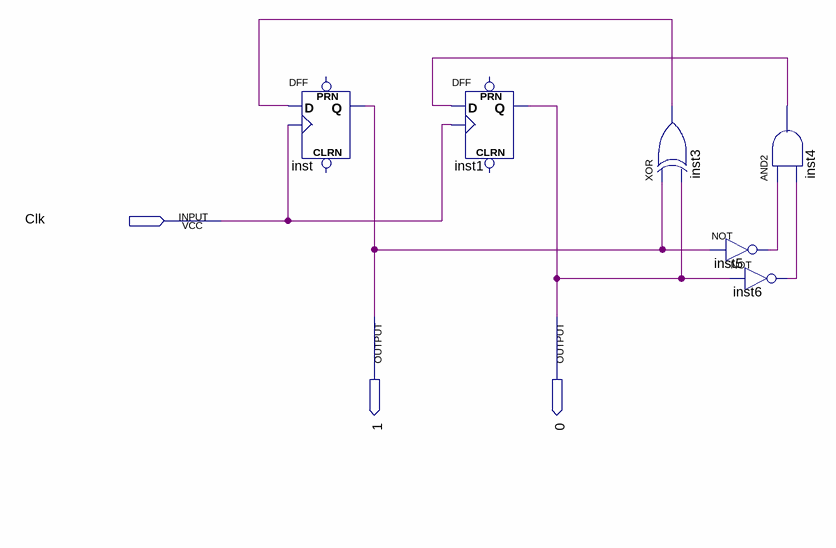
[diagram p0: schematic sheet]
// Quartus schematic Contador2.bdf as structural Verilog: 6 symbols, 3 pins
module Contador2 (
  input  Clk,
  output \1 ,
  output \0 
);

  wire inst3_out, inst4_out, inst5_out, inst6_out;

  DFF inst (.CLK(Clk), .D(inst3_out), .Q(\1 ));  // open: CLRN, PRN
  DFF inst1 (.CLK(Clk), .D(inst4_out), .Q(\0 ));  // open: CLRN, PRN
  xor inst3 (inst3_out, \1 , \0 );
  and inst4 (inst4_out, inst5_out, inst6_out);
  not inst5 (inst5_out, \1 );
  not inst6 (inst6_out, \0 );
endmodule
